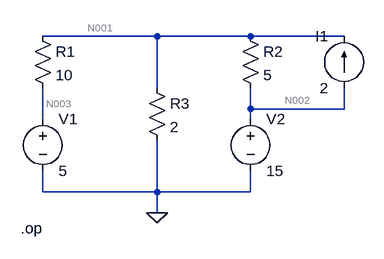
[diagram p0: schematic dc_network.asc]
dc_network.asc, the LTspice schematic file:
Version 4
SHEET 1 880 680
WIRE 112 0 -64 0
WIRE 256 0 112 0
WIRE 400 0 256 0
WIRE 112 80 112 0
WIRE 256 112 256 80
WIRE 400 112 400 80
WIRE 400 112 256 112
WIRE -64 128 -64 80
WIRE 256 128 256 112
WIRE -64 240 -64 208
WIRE 112 240 112 160
WIRE 112 240 -64 240
WIRE 256 240 256 208
WIRE 256 240 112 240
WIRE 112 272 112 240
FLAG 112 272 0
SYMBOL voltage -64 112 R0
WINDOW 123 0 0 Left 2
WINDOW 39 0 0 Left 2
SYMATTR InstName V1
SYMATTR Value 5
SYMBOL res -80 -16 R0
SYMATTR InstName R1
SYMATTR Value 10
SYMBOL res 240 -16 R0
SYMATTR InstName R2
SYMATTR Value 5
SYMBOL res 96 64 R0
SYMATTR InstName R3
SYMATTR Value 2
SYMBOL voltage 256 112 R0
WINDOW 123 0 0 Left 2
WINDOW 39 0 0 Left 2
SYMATTR InstName V2
SYMATTR Value 15
SYMBOL current 400 80 R180
WINDOW 0 24 80 Left 2
WINDOW 3 24 0 Left 2
WINDOW 123 0 0 Left 2
WINDOW 39 0 0 Left 2
SYMATTR InstName I1
SYMATTR Value 2
TEXT -98 296 Left 2 !.op

The netlist it stands for:
* dc_network.asc
V1 N003 0 5
R1 N001 N003 10
R2 N001 N002 5
R3 N001 0 2
V2 N002 0 15
I1 N002 N001 2
.op
.backanno
.end

* Results of the author's LTspice run, read from the files saved beside the schematic
* Operating Point:
*   V(n003) = 5 V
*   V(n001) = 6.875 V
*   V(n002) = 15 V
*   I(I1) = 2 A
*   I(R3) = 3.438 A
*   I(R2) = -1.625 A
*   I(R1) = 187.5 mA
*   I(V2) = -3.625 A
*   I(V1) = 187.5 mA